# Altium schematic sheet F767最小系统V2.0.SchDoc
size A3
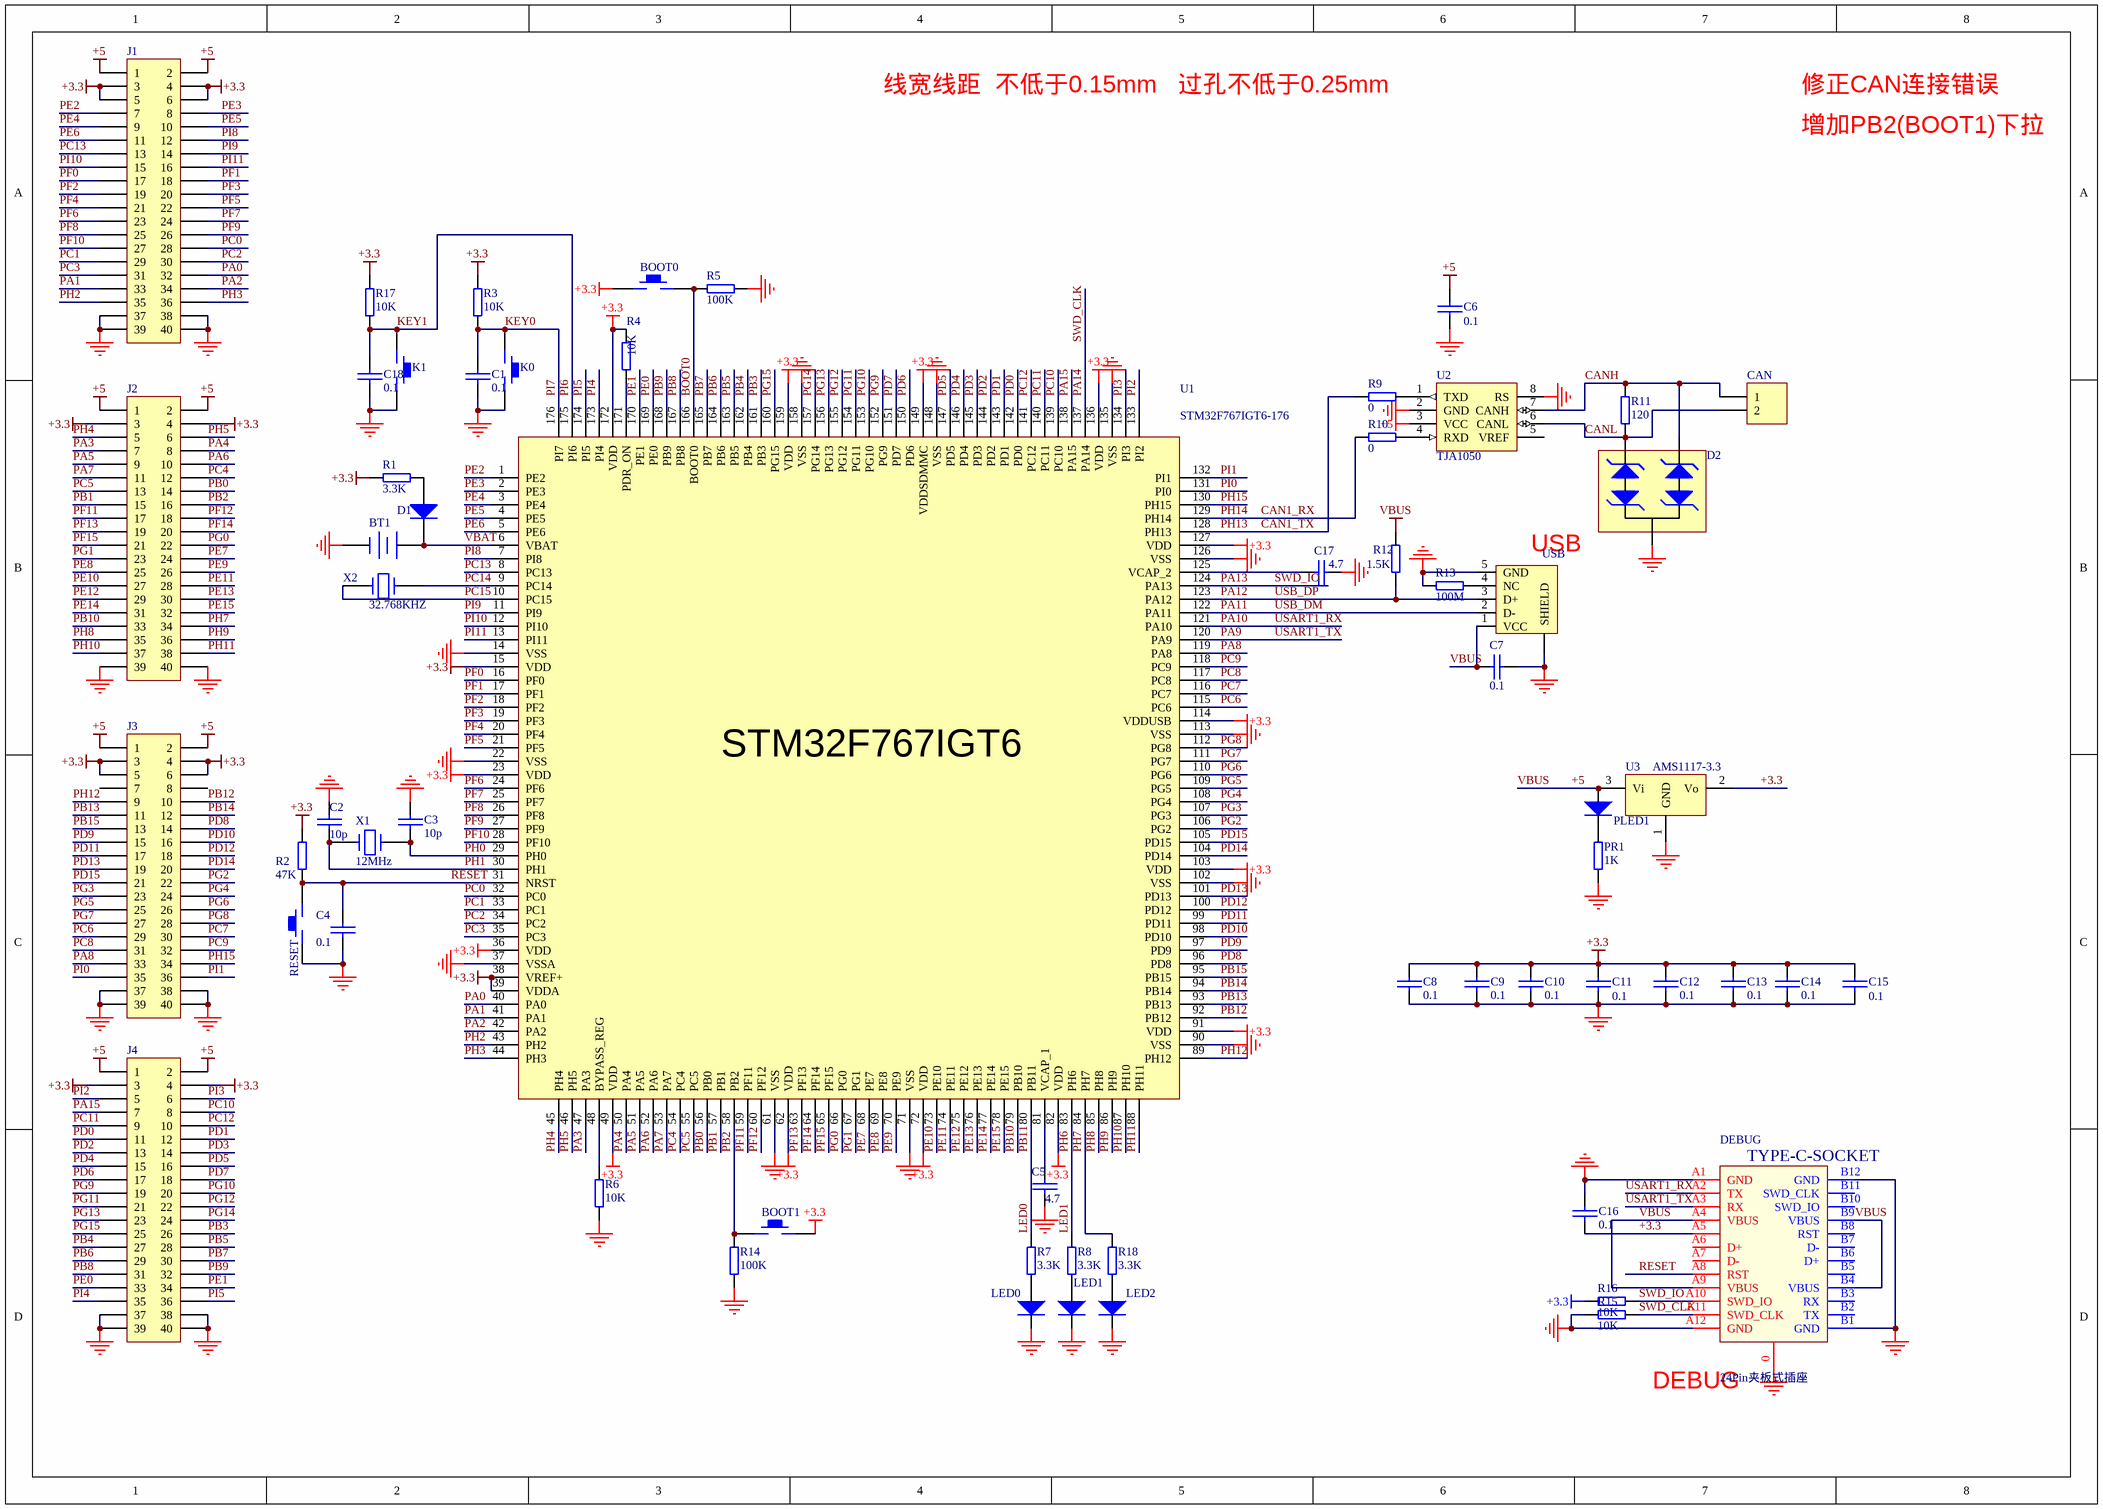
[diagram p0: F767最小系统V2.0.SchDoc]

## Parts
BOOT0  KEY_M  [IN_0603]  (value not drawn)
BOOT1  KEY_M  [IN_0603]  (value not drawn)
BT1  Battery  [CR2032]  (value not drawn)
C1  0.1  [IN_0603]
C2  10p  [IN_0805]
C3  10p  [IN_0805]
C4  0.1  [IN_0603]
C5  4.7  [IN_0805]
C6  0.1  [IN_0603]
C7  0.1  [IN_0603]
C8  0.1  [IN_0603]
C9  0.1  [IN_0603]
C10  0.1  [IN_0603]
C11  0.1  [IN_0603]
C12  0.1  [IN_0603]
C13  0.1  [IN_0603]
C14  0.1  [IN_0603]
C15  0.1  [IN_0603]
C16  0.1  [IN_0603]
C17  4.7  [IN_0805]
C18  0.1  [IN_0603]
CAN  Header 2  [3.5mm-smt-2]  (value not drawn)
D1  1N4148  [IN_0805D]  (value not drawn)
D2  SM712.TCT  [sot-23-123]  (value not drawn)
DEBUG  24Pin夹板式插座  [type-c-24p-socket]
J1  Header 20X2  [HDR2X20]  (value not drawn)
J2  Header 20X2  [HDR2X20]  (value not drawn)
J3  Header 20X2  [HDR2X20]  (value not drawn)
J4  Header 20X2  [HDR2X20]  (value not drawn)
K0  KEY_M  [3625]  (value not drawn)
K1  KEY_M  [3625]  (value not drawn)
LED0  MYLED  [IN_0805D]  (value not drawn)
LED1  MYLED  [IN_0805D]  (value not drawn)
LED2  MYLED  [IN_0805D]  (value not drawn)
PLED1  MYLED  [IN_0805D]  (value not drawn)
PR1  1K  [IN_0603]
R1  3.3K  [IN_0603]
R2  47K  [IN_0603]
R3  10K  [IN_0603]
R4  10K  [IN_0603]
R5  100K  [IN_0603]
R6  10K  [IN_0603]
R7  3.3K  [IN_0603]
R8  3.3K  [IN_0603]
R9  0  [in_0603]
R10  0  [in_0603]
R11  120  [in_0603]
R12  1.5K  [in_0603]
R13  100M  [IN_0603]
R14  100K  [IN_0603]
R15  10K  [IN_0603]
R16  10K  [IN_0603]
R17  10K  [IN_0603]
R18  3.3K  [IN_0603]
RESET  KEY_M  [3625]  (value not drawn)
U1  STM32F767IGT6-176  [LQFP-176]
U2  TJA1050  [SO-8]
U3  AMS1117-3.3  [SOT-223]
USB  USB-AB  [USB-Micro-0.65]  (value not drawn)
X1  12MHz  [OSC-2X6]
X2  32.768KHZ  [OSC-2X6]

## Nets
+3.3: BOOT0.2 BOOT1.1 C8.1 C9.1 C10.1 C11.1 C12.1 C13.1 C14.1 C15.1 C16.1 DEBUG.A5 J1.3 J1.4 J1.5 J1.6 J2.3 J2.4 J3.3 J3.4 J3.5 J3.6 J4.3 J4.4 R1.1 R2.2 R3.2 R4.2 R16.2 R17.2 U1.15(VDD) U1.23(VDD) U1.36(VDD) U1.38(VREF+) U1.39(VDDA) U1.49(VDD) U1.62(VDD) U1.72(VDD) U1.82(VDD) U1.91(VDD) U1.103(VDD) U1.114(VDDUSB) U1.127(VDD) U1.136(VDD) U1.149(VDDSDMMC) U1.159(VDD) U1.172(VDD) U3.2(Vo)
+5: C6.1 C7.2 DEBUG.A4(VBUS) DEBUG.A9(VBUS) DEBUG.B4(VBUS) DEBUG.B9(VBUS) J1.1 J1.2 J2.1 J2.2 J3.1 J3.2 J4.1 J4.2 PLED1.1(A) R12.2 U2.3(VCC) U3.3(Vi) USB.1(VCC)  [also labelled VBUS]
GND: BT1.2(-) C1.2 C2.1 C3.1 C4.2 C5.2 C6.2 C7.1 C8.2 C9.2 C10.2 C11.2 C12.2 C13.2 C14.2 C15.2 C16.2 C17.2 C18.2 D2.3 DEBUG.0(GND) DEBUG.A1(GND) DEBUG.A12(GND) DEBUG.B1(GND) DEBUG.B12(GND) J1.37 J1.38 J1.39 J1.40 J2.39 J2.40 J3.37 J3.38 J3.39 J3.40 J4.37 J4.38 J4.39 J4.40 K0.2 K1.2 LED0.2(K) LED1.2(K) LED2.2(K) PR1.2 R5.2 R6.2 R13.2 R14.2 R15.2 RESET.2 U1.14(VSS) U1.22(VSS) U1.37(VSSA) U1.61(VSS) U1.71(VSS) U1.90(VSS) U1.102(VSS) U1.113(VSS) U1.126(VSS) U1.135(VSS) U1.148(VSS) U1.158(VSS) U2.2(GND) U2.8(RS) U3.1(GND) USB.0(SHIELD) USB.5(GND)
BOOT0: BOOT0.1 R5.1 U1.166(BOOT0)
CAN1_RX: R10.1 U1.129(PH14)  [also labelled PH14]
CAN1_TX: R9.1 U1.128(PH13)  [also labelled PH13]
CANH: CAN.1 D2.2 R11.2 U2.7(CANH)
CANL: CAN.2 D2.1 R11.1 U2.6(CANL)
KEY0: C1.1 K0.1 R3.1 U1.176(PI7)  [also labelled PI7]
KEY1: C18.1 K1.1 R17.1 U1.175(PI6)  [also labelled PI6]
LED0: R7.1 U1.80(PB11)  [also labelled PB11]
LED1: R8.1 U1.83(PH6)  [also labelled PH6]
PA0: J1.32 U1.40(PA0)
PA1: J1.33 U1.41(PA1)
PA2: J1.34 U1.42(PA2)
PA3: J2.7 U1.47(PA3)
PA4: J2.8 U1.50(PA4)
PA5: J2.9 U1.51(PA5)
PA6: J2.10 U1.52(PA6)
PA7: J2.11 U1.53(PA7)
PA8: J3.33 U1.119(PA8)
PA9: DEBUG.A3(RX) U1.120(PA9)  [also labelled USART1_TX]
PA10: DEBUG.A2(TX) U1.121(PA10)  [also labelled USART1_RX]
PA11: U1.122(PA11) USB.2(D-)  [also labelled USB_DM]
PA12: R12.1 U1.123(PA12) USB.3(D+)  [also labelled USB_DP]
PA13: DEBUG.A10(SWD_IO) R16.1 U1.124(PA13)  [also labelled SWD_IO]
PA14: DEBUG.A11(SWD_CLK) R15.1 U1.137(PA14)  [also labelled SWD_CLK]
PA15: J4.7 U1.138(PA15)
PB0: J2.14 U1.56(PB0)
PB1: J2.15 U1.57(PB1)
PB2: BOOT1.2 J2.16 R14.1 U1.58(PB2)
PB3: J4.26 U1.161(PB3)
PB4: J4.27 U1.162(PB4)
PB5: J4.28 U1.163(PB5)
PB6: J4.29 U1.164(PB6)
PB7: J4.30 U1.165(PB7)
PB8: J4.31 U1.167(PB8)
PB9: J4.32 U1.168(PB9)
PB10: J2.33 U1.79(PB10)
PB12: J3.10 U1.92(PB12)
PB13: J3.11 U1.93(PB13)
PB14: J3.12 U1.94(PB14)
PB15: J3.13 U1.95(PB15)
PC0: J1.28 U1.32(PC0)
PC1: J1.29 U1.33(PC1)
PC2: J1.30 U1.34(PC2)
PC3: J1.31 U1.35(PC3)
PC4: J2.12 U1.54(PC4)
PC5: J2.13 U1.55(PC5)
PC6: J3.29 U1.115(PC6)
PC7: J3.30 U1.116(PC7)
PC8: J3.31 U1.117(PC8)
PC9: J3.32 U1.118(PC9)
PC10: J4.8 U1.139(PC10)
PC11: J4.9 U1.140(PC11)
PC12: J4.10 U1.141(PC12)
PC13: J1.13 U1.8(PC13)
PC14: U1.9(PC14) X2.1
PC15: U1.10(PC15) X2.2
PD0: J4.11 U1.142(PD0)
PD1: J4.12 U1.143(PD1)
PD2: J4.13 U1.144(PD2)
PD3: J4.14 U1.145(PD3)
PD4: J4.15 U1.146(PD4)
PD5: J4.16 U1.147(PD5)
PD6: J4.17 U1.150(PD6)
PD7: J4.18 U1.151(PD7)
PD8: J3.14 U1.96(PD8)
PD9: J3.15 U1.97(PD9)
PD10: J3.16 U1.98(PD10)
PD11: J3.17 U1.99(PD11)
PD12: J3.18 U1.100(PD12)
PD13: J3.19 U1.101(PD13)
PD14: J3.20 U1.104(PD14)
PD15: J3.21 U1.105(PD15)
PE0: J4.33 U1.169(PE0)
PE1: J4.34 U1.170(PE1)
PE2: J1.7 U1.1(PE2)
PE3: J1.8 U1.2(PE3)
PE4: J1.9 U1.3(PE4)
PE5: J1.10 U1.4(PE5)
PE6: J1.11 U1.5(PE6)
PE7: J2.24 U1.68(PE7)
PE8: J2.25 U1.69(PE8)
PE9: J2.26 U1.70(PE9)
PE10: J2.27 U1.73(PE10)
PE11: J2.28 U1.74(PE11)
PE12: J2.29 U1.75(PE12)
PE13: J2.30 U1.76(PE13)
PE14: J2.31 U1.77(PE14)
PE15: J2.32 U1.78(PE15)
PF0: J1.17 U1.16(PF0)
PF1: J1.18 U1.17(PF1)
PF2: J1.19 U1.18(PF2)
PF3: J1.20 U1.19(PF3)
PF4: J1.21 U1.20(PF4)
PF5: J1.22 U1.21(PF5)
PF6: J1.23 U1.24(PF6)
PF7: J1.24 U1.25(PF7)
PF8: J1.25 U1.26(PF8)
PF9: J1.26 U1.27(PF9)
PF10: J1.27 U1.28(PF10)
PF11: J2.17 U1.59(PF11)
PF12: J2.18 U1.60(PF12)
PF13: J2.19 U1.63(PF13)
PF14: J2.20 U1.64(PF14)
PF15: J2.21 U1.65(PF15)
PG0: J2.22 U1.66(PG0)
PG1: J2.23 U1.67(PG1)
PG2: J3.22 U1.106(PG2)
PG3: J3.23 U1.107(PG3)
PG4: J3.24 U1.108(PG4)
PG5: J3.25 U1.109(PG5)
PG6: J3.26 U1.110(PG6)
PG7: J3.27 U1.111(PG7)
PG8: J3.28 U1.112(PG8)
PG9: J4.19 U1.152(PG9)
PG10: J4.20 U1.153(PG10)
PG11: J4.21 U1.154(PG11)
PG12: J4.22 U1.155(PG12)
PG13: J4.23 U1.156(PG13)
PG14: J4.24 U1.157(PG14)
PG15: J4.25 U1.160(PG15)
PH0: C3.2 U1.29(PH0) X1.1
PH1: C2.2 U1.30(PH1) X1.2
PH2: J1.35 U1.43(PH2)
PH3: J1.36 U1.44(PH3)
PH4: J2.5 U1.45(PH4)
PH5: J2.6 U1.46(PH5)
PH7: J2.34 R18.1 U1.84(PH7)
PH8: J2.35 U1.85(PH8)
PH9: J2.36 U1.86(PH9)
PH10: J2.37 U1.87(PH10)
PH11: J2.38 U1.88(PH11)
PH12: J3.9 U1.89(PH12)
PH15: J3.34 U1.130(PH15)
PI0: J3.35 U1.131(PI0)
PI1: J3.36 U1.132(PI1)
PI2: J4.5 U1.133(PI2)
PI3: J4.6 U1.134(PI3)
PI4: J4.35 U1.173(PI4)
PI5: J4.36 U1.174(PI5)
PI8: J1.12 U1.7(PI8)
PI9: J1.14 U1.11(PI9)
PI10: J1.15 U1.12(PI10)
PI11: J1.16 U1.13(PI11)
RESET: C4.1 DEBUG.A8(RST) R2.1 RESET.1 U1.31(NRST)
VBAT: BT1.1(+) D1.2(K) U1.6(VBAT)
NetC5_1: C5.1 U1.81(VCAP_1)
NetC17_1: C17.1 U1.125(VCAP_2)
NetD1_1: D1.1(A) R1.2
NetLED0_1: LED0.1(A) R7.2
NetLED1_1: LED1.1(A) R8.2
NetLED2_1: LED2.1(A) R18.2
NetPLED1_2: PLED1.2(K) PR1.1
NetR4_1: R4.1 U1.171(PDR_ON)
NetR6_1: R6.1 U1.48(BYPASS_REG)
NetR9_2: R9.2 U2.1(TXD)
NetR10_2: R10.2 U2.4(RXD)
NetR13_1: R13.1 USB.4(NC)

Not connected (* = marked no-connect by the designer): DEBUG A6(D+) A7(D-) B2(TX) B3(RX) B5 B6(D+) B7(D-) B8(RST) B10(SWD_IO) B11(SWD_CLK); J3 7 8; U2 5(VREF)

## Notes on the sheet
- 线宽线距  不低于0.15mm   过孔不低于0.25mm
- 修正CAN连接错误
- 增加PB2(BOOT1)下拉
- (near USB) USB
- DEBUG
- (in symbol STM32F767IGT6-176) STM32F767IGT6

## Library data of the parts
BT1 = Battery: Multicell Battery; Published: 24-Mar-1999; LatestRevisionDate: 17-Jul-2002; LatestRevisionNote: Re-released for DXP Platform.; PackageReference: BAT-2; Publisher: Altium Limited; PackageDescription: Battery; 2 Leads
C1-C18 = CAP: Capacitor
CAN = Header 2: Header, 2-Pin; LatestRevisionDate: 17-Jul-2002; LatestRevisionNote: Re-released for DXP Platform.; Publisher: Altium Limited
D1 = Diode: Default Diode; Published: 8-Jun-2000; LatestRevisionDate: 17-Jul-2002; LatestRevisionNote: Re-released for DXP Platform.; PackageVersion: Sep-1996; PackageReference: SMC; Publisher: Altium Limited; PackageDescription: DO-214-AB/SMC; 2 C-Bend Leads; Body 7.9 x 5.9 mm, inc. leads (LxW); Code_JEDEC: DO-214-AB
D2 = TVS-712: 非对称双TVS RS485 7/12V 保护
DEBUG = TYPE-C-SOCKET: 两边均有焊点
J1-J4 = Header 20X2: Header, 20-Pin, Dual row; LatestRevisionDate: 17-Jul-2002; LatestRevisionNote: Re-released for DXP Platform.; Publisher: Altium Limited
PR1 R1-R18 = RES2
U2 = TJA1050: CAN收发芯片
U3 = AMS1117
X1 X2 = CRYSTAL: 晶振